# EAGLE schematic Platypus_v1_0_Proto_v3_0 (EAGLE 7.2.0)
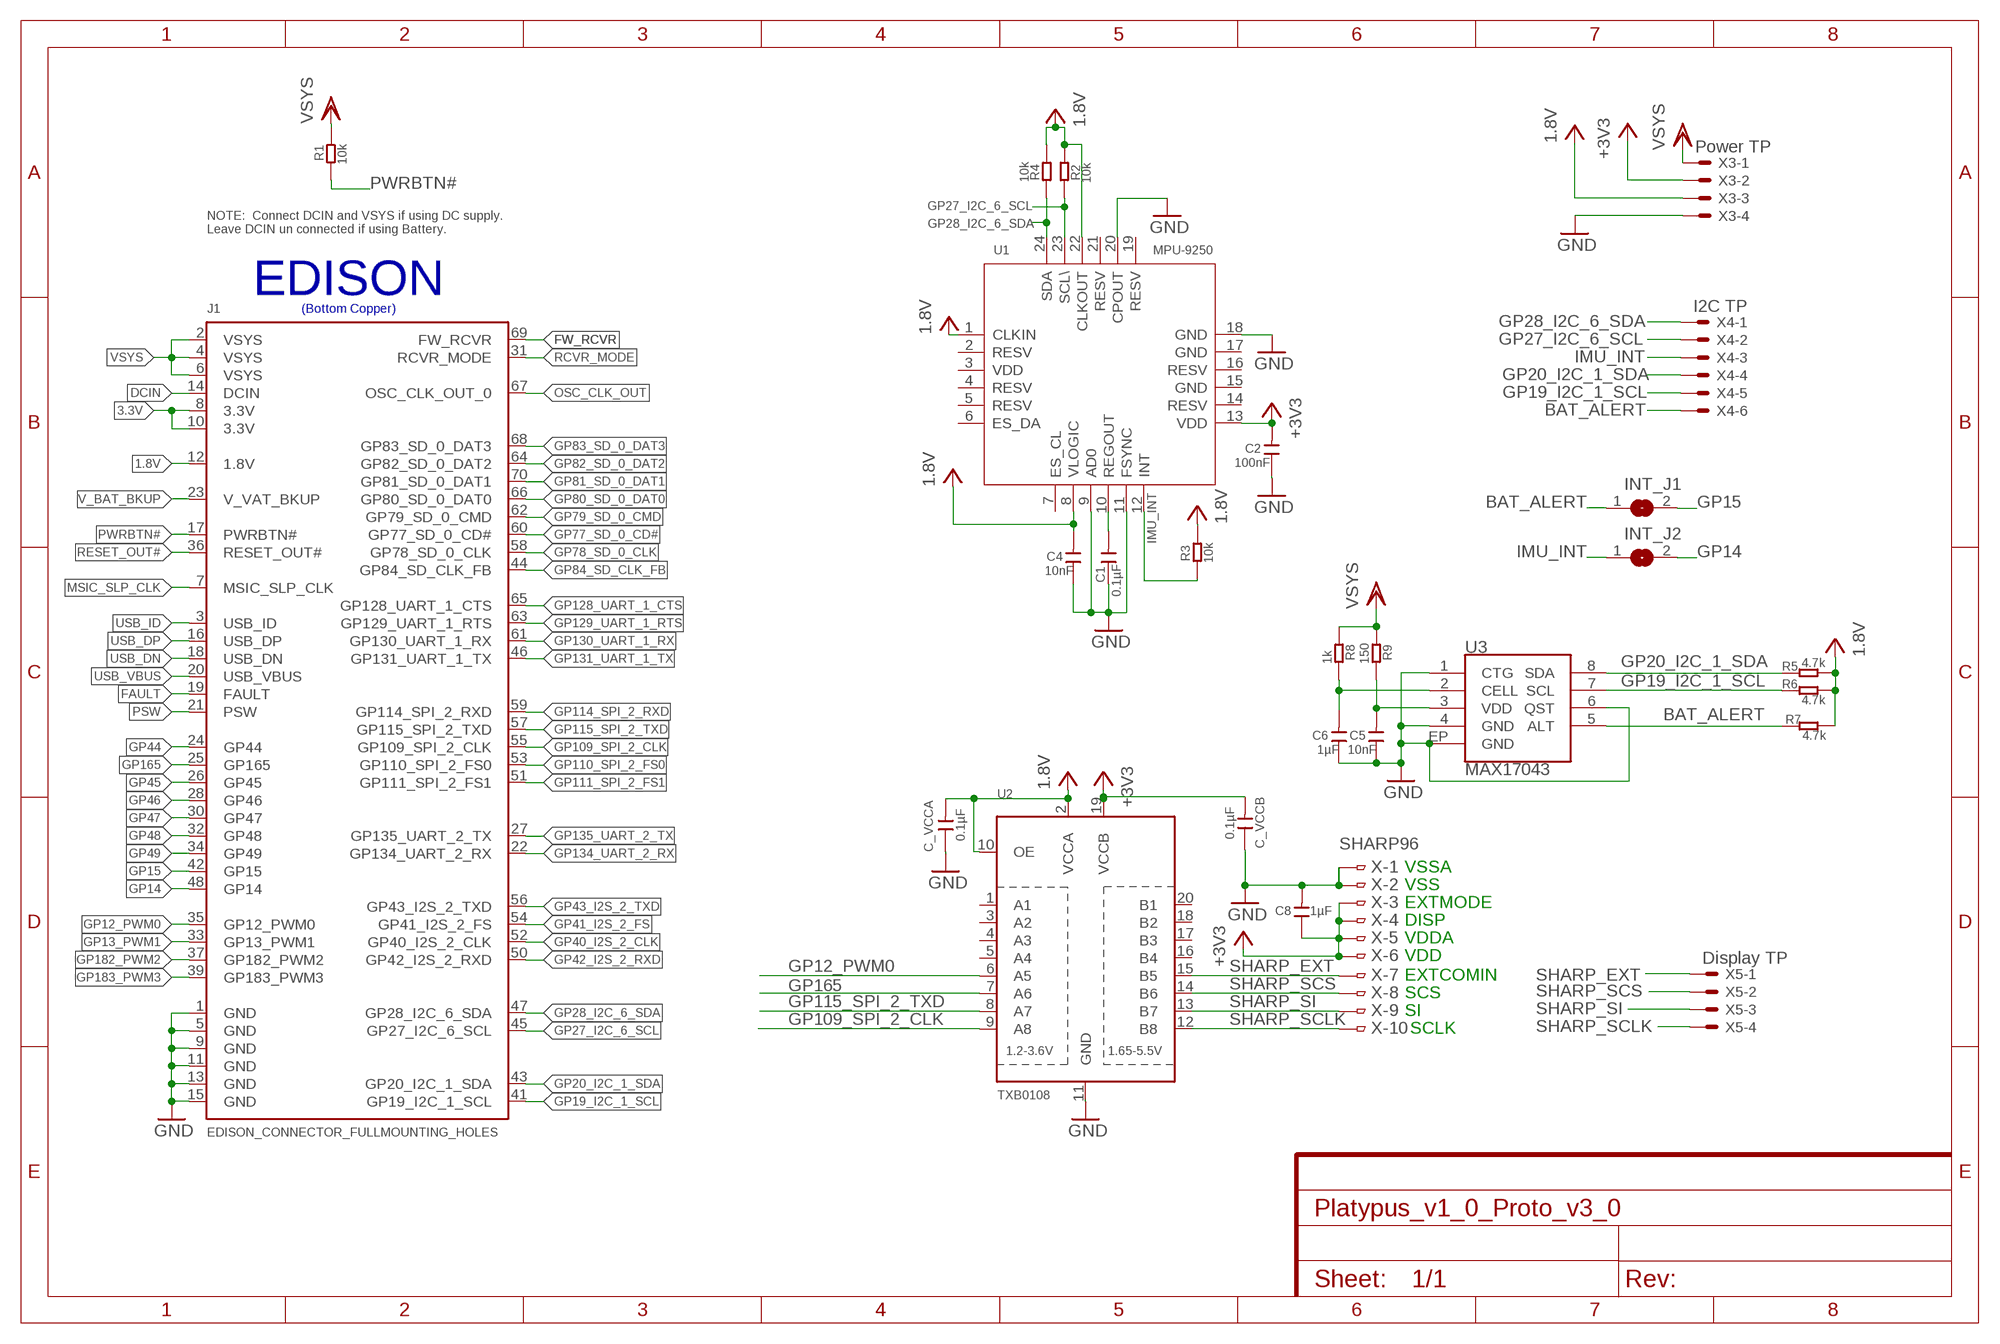
[diagram p0: schematic, sheet 1]

## Parts
C1  0.1µF  C-0603  [C0603]
C2  100nF  C-0603  [C0603]
C4  10nF  C-0603  [C0603]
C5  10nF  C-0603  [C0603]
C6  1µF  C-0603  [C0603]
C8  1µF  C-0603  [C0603]
C_VCCA  0.1µF  C-0603  [C0603]
C_VCCB  0.1µF  C-0603  [C0603]
INT_J1  SJ  [SJ]
INT_J2  SJ  [SJ]
J1  EDISON_CONNECTOR_FULLMOUNTING_HOLES  [EDISON_DAUGHTER]
R1  10k  R-0603  [R0603]
R2  10k  R-0603  [R0603]
R3  10k  R-0603  [R0603]
R4  10k  R-0603  [R0603]
R5  4.7k  R-0603  [R0603]
R6  4.7k  R-0603  [R0603]
R7  4.7k  R-0603  [R0603]
R8  1k  R-0603  [R0603]
R9  150  R-0603  [R0603]
U1  MPU-9250  MPU-9150  [LGA-24]
U2  TXB0108  TXB0108PWR  [TSSOP20]
U3  MAX17043  MAX1704X  [TDFN-8]
X  SHARP96  FH12-10S-0.5SH  [FH12-10S-0.5SH]
X3  Power TP  53047-04  [53047-04]
X4  I2C TP  53047-06  [53047-06]
X5  Display TP  53047-04  [53047-04]

## Nets
1.8V: C4.2 C_VCCA.2 J1.12(1.8V) R2.1 R3.2 R4.2 R5.2 R6.2 R7.1 U1.1(CLKIN) U1.8(VLOGIC) U1.22(CLKOUT) U2.2(VCCA) U2.10(OE) X3.3
3.3V: C2.2 C8.1 C_VCCB.2 J1.8(3.3V) J1.10(3.3V) U1.13(VDD) U2.19(VCCB) X3.2 X.3 X.4 X.5 X.6 ; supply symbol labelled +3V3
BAT_ALERT: INT_J1.1 R7.2 U3.5(ALT) X4.6
DCIN: J1.14(DCIN)
FAULT: J1.19(FAULT)
FW_RCVR: J1.69(FW_RCVR)
GND: C1.1 C2.1 C4.1 C5.1 C6.1 C8.2 C_VCCA.1 C_VCCB.1 J1.1(GND) J1.5(GND) J1.9(GND) J1.11(GND) J1.13(GND) J1.15(GND) U1.9(AD0) U1.11(FSYNC) U1.18(GND) U1.20(CPOUT) U2.11(GND) U3.1(CTG) U3.4(GND) U3.6(QST) U3.EP(GND) X3.4 X.1 X.2
GP12_PWM0: J1.35(GP12_PWM0) U2.6(A5)
GP13_PWM1: J1.33(GP13_PWM1)
GP14: INT_J2.2 J1.48(GP14)
GP15: INT_J1.2 J1.42(GP15)
GP19_I2C_1_SCL: J1.41(GP19_I2C_1_SCL) R6.1 U3.7(SCL) X4.5
GP20_I2C_1_SDA: J1.43(GP20_I2C_1_SDA) R5.1 U3.8(SDA) X4.4
GP27_I2C_6_SCL: J1.45(GP27_I2C_6_SCL) R2.2 U1.23(SCL\) X4.2
GP28_I2C_6_SDA: J1.47(GP28_I2C_6_SDA) R4.1 U1.24(SDA) X4.1
GP40_I2S_2_CLK: J1.52(GP40_I2S_2_CLK)
GP41_I2S_2_FS: J1.54(GP41_I2S_2_FS)
GP42_I2S_2_RXD: J1.50(GP42_I2S_2_RXD)
GP43_I2S_2_TXD: J1.56(GP43_I2S_2_TXD)
GP44: J1.24(GP44)
GP45: J1.26(GP45)
GP46: J1.28(GP46)
GP47: J1.30(GP47)
GP48: J1.32(GP48)
GP49: J1.34(GP49)
GP77_SD_0_CD#: J1.60(GP77_SD_0_CD#)
GP78_SD_0_CLK: J1.58(GP78_SD_0_CLK)
GP79_SD_0_CMD: J1.62(GP79_SD_0_CMD)
GP80_SD_0_DAT0: J1.66(GP80_SD_0_DAT0)
GP81_SD_0_DAT1: J1.70(GP81_SD_0_DAT1)
GP82_SD_0_DAT2: J1.64(GP82_SD_0_DAT2)
GP83_SD_0_DAT3: J1.68(GP83_SD_0_DAT3)
GP84_SD_CLK_FB: J1.44(GP84_SD_CLK_FB)
GP109_SPI_2_CLK: J1.55(GP109_SPI_2_CLK) U2.9(A8)
GP110_SPI_2_FS0: J1.53(GP110_SPI_2_FS0)
GP111_SPI_2_FS1: J1.51(GP111_SPI_2_FS1)
GP114_SPI_2_RXD: J1.59(GP114_SPI_2_RXD)
GP115_SPI_2_TXD: J1.57(GP115_SPI_2_TXD) U2.8(A7)
GP128_UART_1_CTS: J1.65(GP128_UART_1_CTS)
GP129_UART_1_RTS: J1.63(GP129_UART_1_RTS)
GP130_UART_1_RX: J1.61(GP130_UART_1_RX)
GP131_UART_1_TX: J1.46(GP131_UART_1_TX)
GP134_UART_2_RX: J1.22(GP134_UART_2_RX)
GP135_UART_2_TX: J1.27(GP135_UART_2_TX)
GP165: J1.25(GP165) U2.7(A6)
GP182_PWM2: J1.37(GP182_PWM2)
GP183_PWM3: J1.39(GP183_PWM3)
IMU_INT: INT_J2.1 R3.1 U1.12(INT) X4.3
MSIC_SLP_CLK: J1.7(MSIC_SLP_CLK)
N$5: C1.2 U1.10(REGOUT)
N$6: C6.2 R8.1 U3.2(CELL)
N$13: C5.2 R9.1 U3.3(VDD)
OSC_CLK_OUT: J1.67(OSC_CLK_OUT_0)
PSW: J1.21(PSW)
PWRBTN#: J1.17(PWRBTN#) R1.1
RCVR_MODE: J1.31(RCVR_MODE)
RESET_OUT#: J1.36(RESET_OUT#)
SHARP_EXT: U2.15(B5) X5.1 X.7
SHARP_SCLK: U2.12(B8) X5.4 X.10
SHARP_SCS: U2.14(B6) X5.2 X.8
SHARP_SI: U2.13(B7) X5.3 X.9
USB_DN: J1.18(USB_DN)
USB_DP: J1.16(USB_DP)
USB_ID: J1.3(USB_ID)
USB_VBUS: J1.20(USB_VBUS)
V_BAT_BKUP: J1.23(V_VAT_BKUP)
VSYS: J1.2(VSYS) J1.4(VSYS) J1.6(VSYS) R1.2 R8.2 R9.2 X3.1
Unconnected: U1.2(RESV) U1.3(VDD) U1.4(RESV) U1.5(RESV) U1.6(ES_DA) U1.7(ES_CL) U1.14(RESV) U1.15(GND) U1.16(RESV) U1.17(GND) U1.19(RESV) U1.21(RESV) U2.1(A1) U2.3(A2) U2.4(A3) U2.5(A4) U2.16(B4) U2.17(B3) U2.18(B2) U2.20(B1)

## Notes on the sheet
- NOTE:  Connect DCIN and VSYS if using DC supply.
  Leave DCIN un connected if using Battery.
- EDISON
- (Bottom Copper)
- VSSA
- VSS
- EXTMODE
- DISP
- VDDA
- VDD
- EXTCOMIN
- SCS
- SI
- SCLK

## Library data of the parts
C1 C2 C4-C6 C8 C_VCCA C_VCCB = Discrete:C*: Ceramic Capacitors
INT_J1 INT_J2 = jumper:SJ: SMD solder JUMPER
J1 = Edison:EDISON_CONNECTOR_FULL
R1-R9 = Discrete:R*
U1 = template:MPU-9150
U2 = adafruit:TXB0108PWR: 8-Bit Bi-Directional Level Shifter 1.2V-3.6V (VCCA) to 1.65V-5.5V (VCCB) bi-directional level shifter with auto direction sensing. Max data rate - VCCA 1.8V: 20Mbps (50ns), VCCA 3.3V: 100Mbps (10ns) Digikey: 296-21527-1-ND
U3 = SparkFun-PowerIC:MAX1704X: MAX17043/MAX17044: Battery Fuel Guage (43 is 1cell, 44 is 2cell); PROD-ID: IC-10399
X = con-hirose:FH12-10S-0.5S: 0.5mm Pitch Connectors For FPC/FFC Source: Data sheet <http://www.hirose.co.jp/cataloge_hp/e58605370.pdf>; MPN: FH12-10S-0.5SH(55); OC_FARNELL: 1324540; OC_NEWARK: 34M6152
X3 X5 = con-molex:53?-04: CONNECTOR wire to board 1.25 mm (.049 inch) pitch header; MF: WALDOM/MOLEX; MPN: 53047-0410; OC_FARNELL: 9733060; OC_NEWARK: 38C9900
X4 = con-molex:53?-06: CONNECTOR wire to board 1.25 mm (.049 inch) pitch header; MPN: 53047-0610-C; OC_FARNELL: 9733078; OC_NEWARK: 03M2965